# EAGLE design PIO-Dev-Lite (EAGLE 9.6.2)
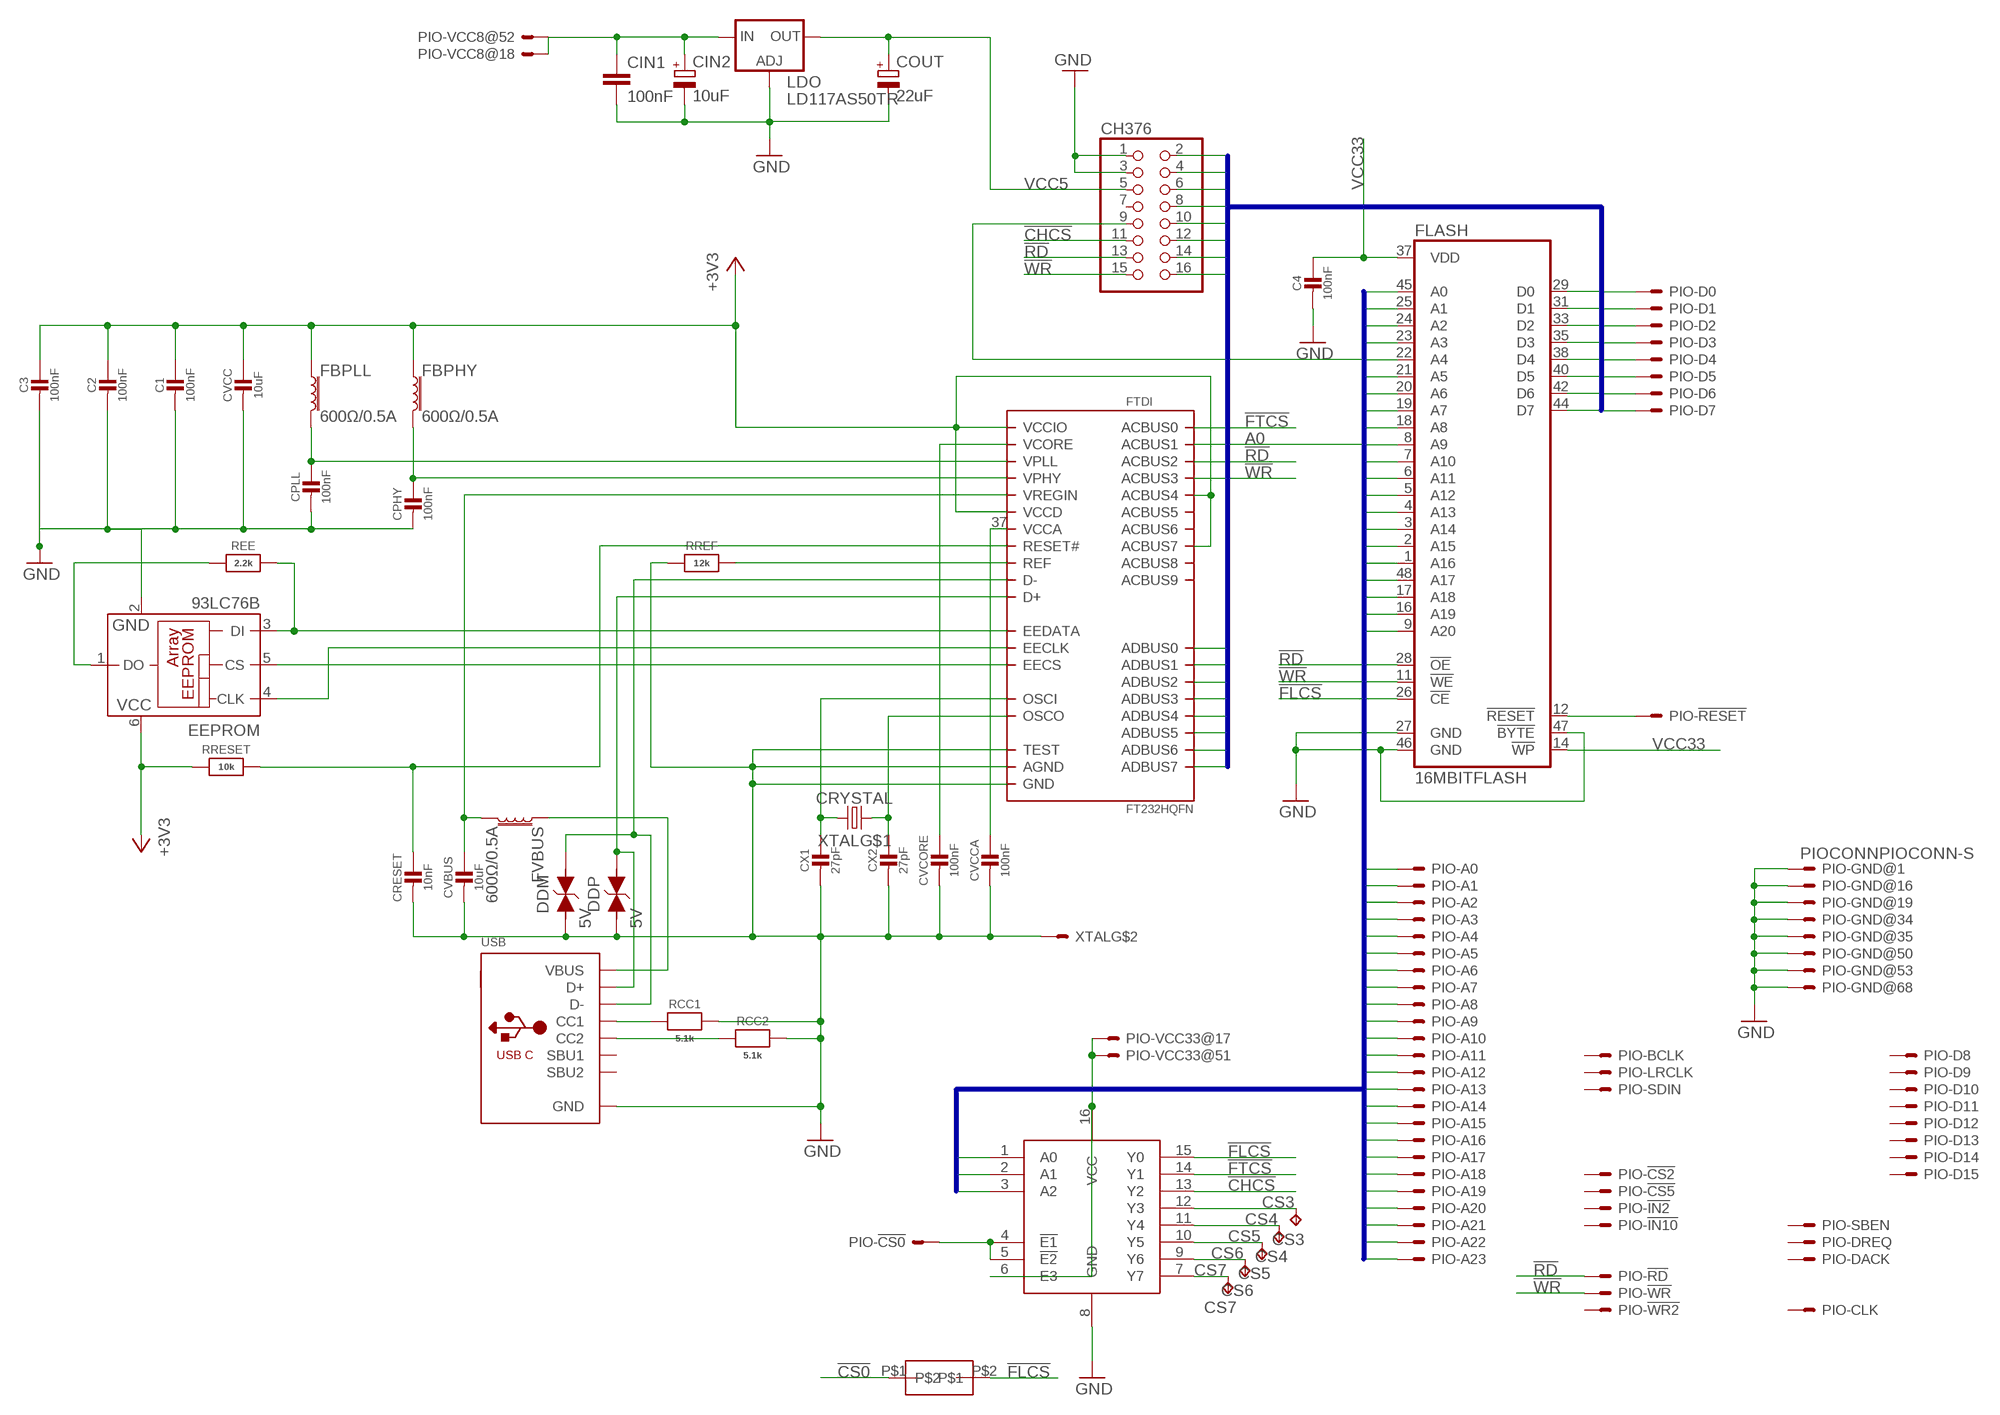
[diagram p0: schematic, sheet 1]

## Parts
C1  100nF  CAPACITOR0603  [0603]
C2  100nF  CAPACITOR0603  [0603]
C3  100nF  CAPACITOR0603  [0603]
C4  100nF  CAPACITOR0603  [0603]
CH376  PINHD-2X8  [2X08]
CIN1  100nF  C-EUC0603K  [C0603K]
CIN2  10uF  CPOL-EUA/3216-18W  [A/3216-18W]
COUT  22uF  CPOL-EUA/3216-18W  [A/3216-18W]
CPHY  100nF  CAPACITOR0603  [0603]
CPLL  100nF  CAPACITOR0603  [0603]
CRESET  10nF  CAPACITOR0603  [0603]
CS3  TP  [TP]
CS4  TP  [TP]
CS5  TP  [TP]
CS6  TP  [TP]
CS7  TP  [TP]
CVBUS  10uF  CAPACITOR1206  [1206]
CVCC  10uF  CAPACITOR1206  [1206]
CVCCA  100nF  CAPACITOR0603  [0603]
CVCORE  100nF  CAPACITOR0603  [0603]
CX1  27pF  CAPACITOR0402  [0402]
CX2  27pF  CAPACITOR0402  [0402]
DDM  5V  WE-VE_0603_82356050050  [WE-VE_0603]
DDP  5V  WE-VE_0603_82356050050  [WE-VE_0603]
DECODER  74HC138  [TSSOP16]
EEPROM  93LC76B  [SOT23-6]
FBPHY  600Ω/0.5A  FERRITE_BEAD-0603  [0603]
FBPLL  600Ω/0.5A  FERRITE_BEAD-0603  [0603]
FLASH  16MBITFLASH  [TSOP48]
FTDI  FT232HQFN  [QFN48_8MM]
FVBUS  600Ω/0.5A  FERRITE_BEAD-0603  [0603]
LDO  LD117AS50TR  [SOT223]
NOUSB  SMD-JUMPER  [SMD-JUMPER]
PIO  PIOCONNPIOCONN-S  [PIOCONN]
RCC1  5.1k  RESISTOR0402  [0402]
RCC2  5.1k  RESISTOR0402  [0402]
REE  2.2k  RESISTOR0603  [0603]
RREF  12k  RESISTOR0603  [0603]
RRESET  10k  RESISTOR0603  [0603]
USB  USB-C  [USB-C]
XTAL  CRYSTAL  [SMD3225-4P]

## Nets
!CHCS: CH376.11 DECODER.13(Y2)
!CS0: DECODER.4(!E1) DECODER.5(!E2) NOUSB.P$1 PIO.4
!FLCS: DECODER.15(Y0) FLASH.26(!CE) NOUSB.P$2
!FTCS: DECODER.14(Y1) FTDI.21(ACBUS0)
!RD: CH376.13 FLASH.28(!OE) FTDI.26(ACBUS2) PIO.30
!RESET: FLASH.12(!RESET) PIO.2
!RESET_FT: CRESET.1 FTDI.34(RESET#) RRESET.2
!WR: CH376.15 FLASH.11(!WE) FTDI.27(ACBUS3) PIO.64
+3V3: C1.1 C2.1 C3.1 CVCC.1 EEPROM.6(VCC) FBPHY.1 FBPLL.1 FTDI.12(VCCIO) FTDI.24(VCCIO) FTDI.28(ACBUS4) FTDI.31(ACBUS7) FTDI.39(VCCD) FTDI.46(VCCIO) RRESET.1
A0: CH376.9 FLASH.45(A0) FTDI.25(ACBUS1) PIO.14
A1: FLASH.25(A1) PIO.48
A2: FLASH.24(A2) PIO.15
A3: FLASH.23(A3) PIO.49
A4: FLASH.22(A4) PIO.20
A5: FLASH.21(A5) PIO.54
A6: FLASH.20(A6) PIO.21
A7: FLASH.19(A7) PIO.55
A8: FLASH.18(A8) PIO.22
A9: FLASH.8(A9) PIO.56
A10: FLASH.7(A10) PIO.23
A11: FLASH.6(A11) PIO.57
A12: FLASH.5(A12) PIO.24
A13: FLASH.4(A13) PIO.58
A14: FLASH.3(A14) PIO.25
A15: FLASH.2(A15) PIO.59
A16: FLASH.1(A16) PIO.26
A17: FLASH.48(A17) PIO.60
A18: FLASH.17(A18) PIO.27
A19: FLASH.16(A19) PIO.61
A20: FLASH.9(A20) PIO.28
A21: DECODER.1(A0) PIO.62
A22: DECODER.2(A1) PIO.29
A23: DECODER.3(A2) PIO.63
CC1: RCC1.1 USB.A5(CC1)
CC2: RCC2.1 USB.B5(CC2)
CS3: CS3.P$1(TP) DECODER.12(Y3)
CS4: CS4.P$1(TP) DECODER.11(Y4)
CS5: CS5.P$1(TP) DECODER.10(Y5)
CS6: CS6.P$1(TP) DECODER.9(Y6)
CS7: CS7.P$1(TP) DECODER.7(Y7)
D0: CH376.2 FLASH.29(D0) FTDI.13(ADBUS0) PIO.6
D1: CH376.4 FLASH.31(D1) FTDI.14(ADBUS1) PIO.40
D2: CH376.6 FLASH.33(D2) FTDI.15(ADBUS2) PIO.7
D3: CH376.8 FLASH.35(D3) FTDI.16(ADBUS3) PIO.41
D4: CH376.10 FLASH.38(D4) FTDI.17(ADBUS4) PIO.8
D5: CH376.12 FLASH.40(D5) FTDI.18(ADBUS5) PIO.42
D6: CH376.14 FLASH.42(D6) FTDI.19(ADBUS6) PIO.9
D7: CH376.16 FLASH.44(D7) FTDI.20(ADBUS7) PIO.43
DM: DDM.1 FTDI.6(D-) USB.A7(D-) USB.B7(D-)
DP: DDP.1 FTDI.7(D+) USB.A6(D+) USB.B6(D+)
EECLK: EEPROM.4(CLK) FTDI.44(EECLK)
EECS: EEPROM.5(CS) FTDI.45(EECS)
EEDATA: EEPROM.3(DI) FTDI.43(EEDATA) REE.2
EEDO: EEPROM.1(DO) REE.1
GND: C1.2 C2.2 C3.2 C4.2 CH376.1 CH376.3 CIN1.2 CIN2.- COUT.- CPHY.2 CPLL.2 CRESET.2 CVBUS.2 CVCC.2 CVCCA.2 CVCORE.2 CX1.2 CX2.2 DDM.2 DDP.2 DECODER.8(GND) EEPROM.2(GND) FLASH.27(GND) FLASH.46(GND) FLASH.47(!BYTE) FTDI.4(AGND) FTDI.9(AGND) FTDI.10(GND) FTDI.11(GND) FTDI.22(GND) FTDI.23(GND) FTDI.35(GND) FTDI.36(GND) FTDI.41(AGND) FTDI.42(TEST) FTDI.47(GND) FTDI.48(GND) FTDI.THERMAL(GND) LDO.1(ADJ) PIO.1 PIO.16 PIO.19 PIO.34 PIO.35 PIO.50 PIO.53 PIO.68 RCC1.2 RCC2.2 RREF.1 USB.A1B12(GND) USB.B1A12(GND) USB.M1(GND) USB.M2(GND) USB.M3(GND) USB.M4(GND) XTAL.P$2(S) XTAL.P$4(S)
REF: FTDI.5(REF) RREF.2
VBUS: FVBUS.1 USB.A4B9(VBUS) USB.B4A9(VBUS)
VCC5: CH376.5 COUT.+ LDO.4(OUT)
VCC8: CIN1.1 CIN2.+ LDO.3(IN) PIO.18 PIO.52
VCC33: C4.1 DECODER.6(E3) DECODER.16(VCC) FLASH.14(!WP) FLASH.37(VDD) PIO.17 PIO.51
VCCA: CVCCA.1 FTDI.37(VCCA)
VCORE: CVCORE.1 FTDI.38(VCORE)
VPHY: CPHY.1 FBPHY.2 FTDI.3(VPHY)
VPLL: CPLL.1 FBPLL.2 FTDI.8(VPLL)
VREGIN: CVBUS.1 FTDI.40(VREGIN) FVBUS.2
XI: CX1.1 FTDI.1(OSCI) XTAL.P$1(X1)
XO: CX2.1 FTDI.2(OSCO) XTAL.P$3(X2)
Unconnected: CH376.7 FTDI.29(ACBUS5) FTDI.30(ACBUS6) FTDI.32(ACBUS8) FTDI.33(ACBUS9) PIO.3 PIO.5 PIO.10 PIO.11 PIO.12 PIO.13 PIO.31 PIO.32 PIO.33 PIO.36 PIO.37 PIO.38 PIO.39 PIO.44 PIO.45 PIO.46 PIO.47 PIO.65 PIO.66 PIO.67 USB.A8(SBU1) USB.B8(SBU2)

## Buses
A[0..23]
D[0..7]

## Library data of the parts
C1-C4 CPHY CPLL CRESET CVBUS CVCC CVCCA CVCORE CX1 CX2 = pixel:CAPACITOR
CH376 = pinhead:PINHD-2X8: PIN HEADER
CIN1 = rcl:C-EU: CAPACITOR, European symbol; SPICEPREFIX: C
CIN2 COUT = rcl:CPOL-EU: POLARIZED CAPACITOR, European symbol; SPICEPREFIX: C
CS3-CS7 = pixel:TP
DDM DDP = Wurth_EMC Components_WE-VE:WE-VE_0603: WE-VE ESD Suppressor Characteristics Fast response time No leakage current Low clamping voltage Almost no energy consumption in stand-by mode Excellent absorption for ESD-impulses Operating temperature: –40 ºC to +85 ºC Nickel barrier Applications Protection of data lines Protection of bus systems Protection of semiconductors ESD protection in accordance with EN 61000-4-2: – 8 kV contact discharge – 15 kV air discharge <https://katalog.we-online.de/media/images/v2/o14891v209%20Family_WE-VE.jpg> Details see: https://katalog.we-online.de/en/pbs/WE-VE Updated by Ella Wu 2019-07-04 2019 (C) Wurth Elektronik; DATASHEET-URL: https://katalog.we-online.de/pbs/datasheet/82356050050.pdf; ILEAK: 1uA; MOUNT: SMT; PART-NUMBER: 82356050050; RISO: 10 MOhm; VCLAMP-TYP: 75V; VESD-AIR: 15kV
DECODER = pixel:74HC138
EEPROM = microchip:93*76?: 8K Microwire Compatible Serial EEPROM Source: http://ww1.microchip.com/downloads/en/DeviceDoc/21796H.pdf; MF: MICROCHIP; MPN: 93LC76BT-I/OT; OC_FARNELL: 1556170; OC_NEWARK: 61H6848
FBPHY FBPLL FVBUS = SparkFun-Coils:FERRITE_BEAD: Ferrite Bead (blocks, cores, rings, chokes, etc.) Inductor with layers of ferrite used to suppress high frequencies. Often used to isolate high frequency noise. SparkFun Products: IOIO-OTG - V2.2 <https://www.sparkfun.com/products/13613> SparkFun SAMD21 Mini Breakout <https://www.sparkfun.com/products/13664> SparkFun 6 Degrees of Freedom Breakout - LSM6DS3 <https://www.sparkfun.com/products/13339> SparkFun SAMD21 Dev Breakout <https://www.sparkfun.com/products/13672>; PROD_ID: NDUC-07859; VALUE: 30Ω/1.8A
FLASH = pixel:16MBITFLASH
FTDI = pixel:FT232H
LDO = v-reg:LD117A?*: Low drop fixed and adjustable positive voltage regulators 1 A Source: http://www.st.com/stonline/products/literature/ds/7194/ld1117axx.pdf
NOUSB = pixel:SMD-JUMPER
PIO = pixel:PIOCONN: CONNECTOR 68-pin 1.27mm (.050 inch) pitch SCSI+ unshielded receptacle right angle all plastic
RCC1 RCC2 REE RREF RRESET = pixel:RESISTOR
USB = pixel:USB-C: USB Type-C USB 2.0 Connector
XTAL = pixel:CRYSTAL

## Board
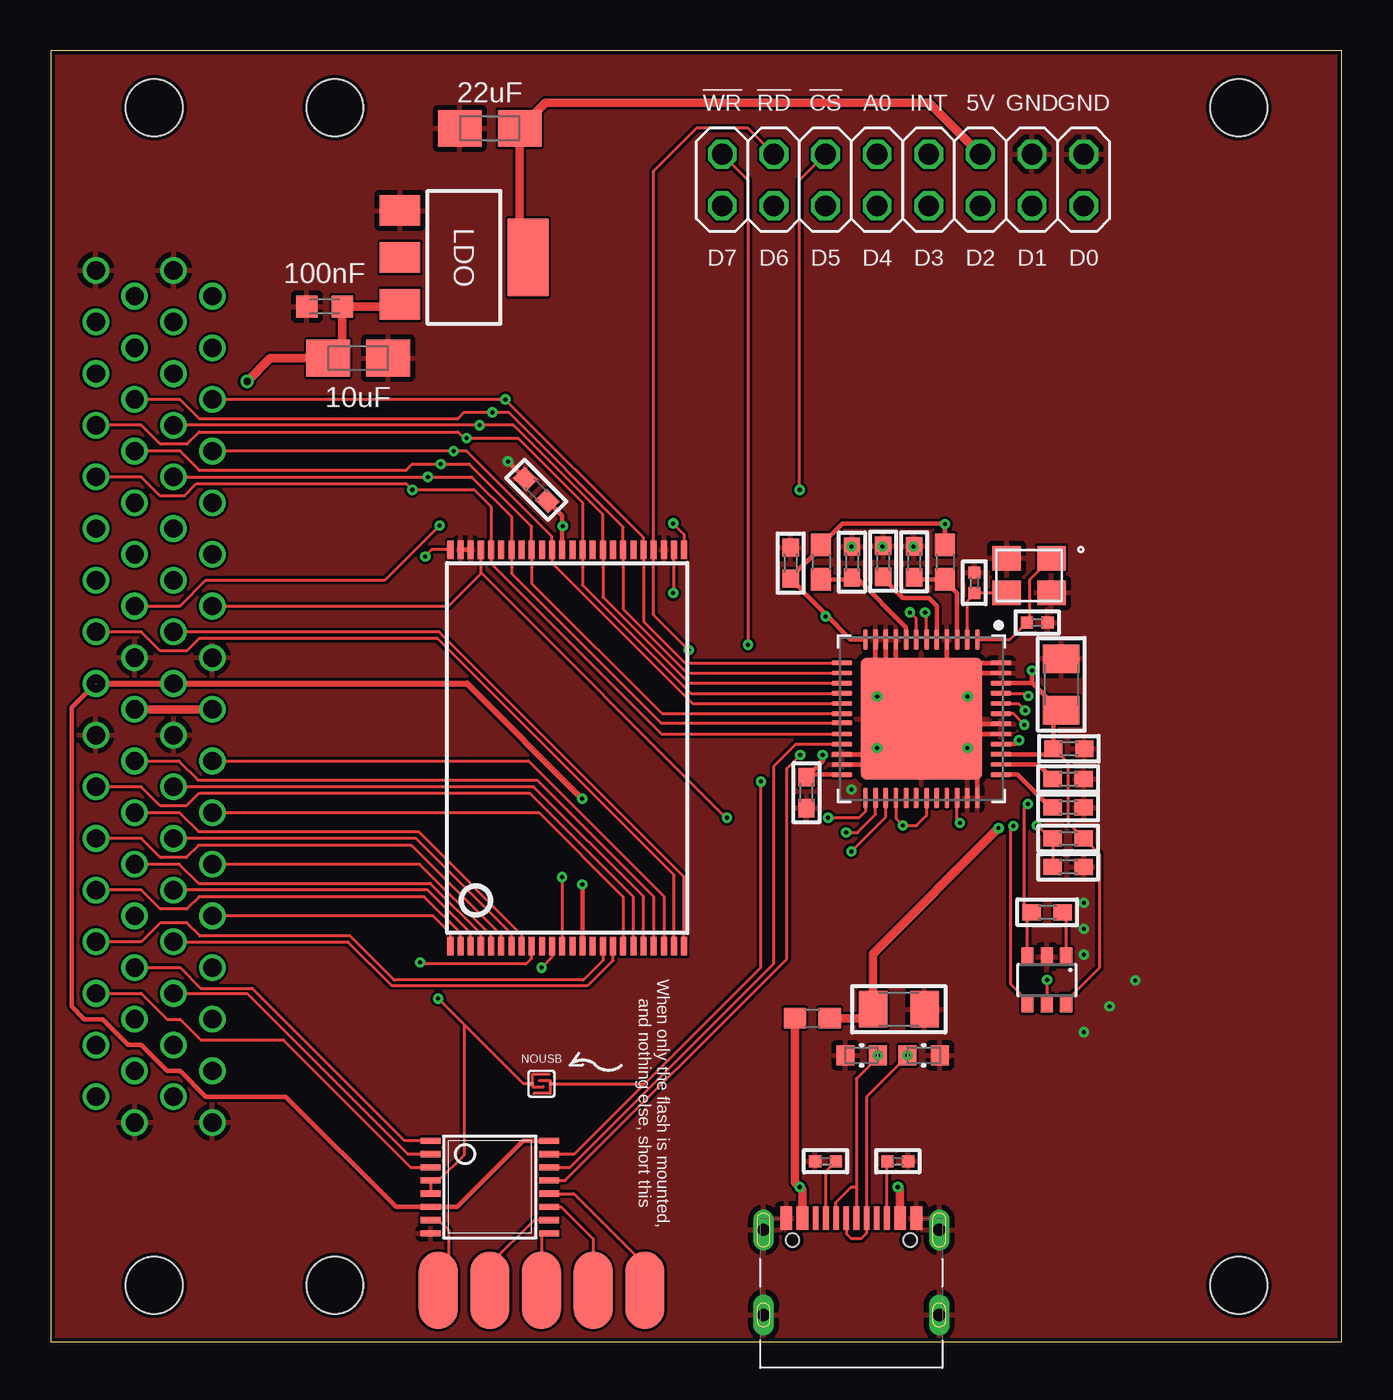
[diagram p1: board, top side]
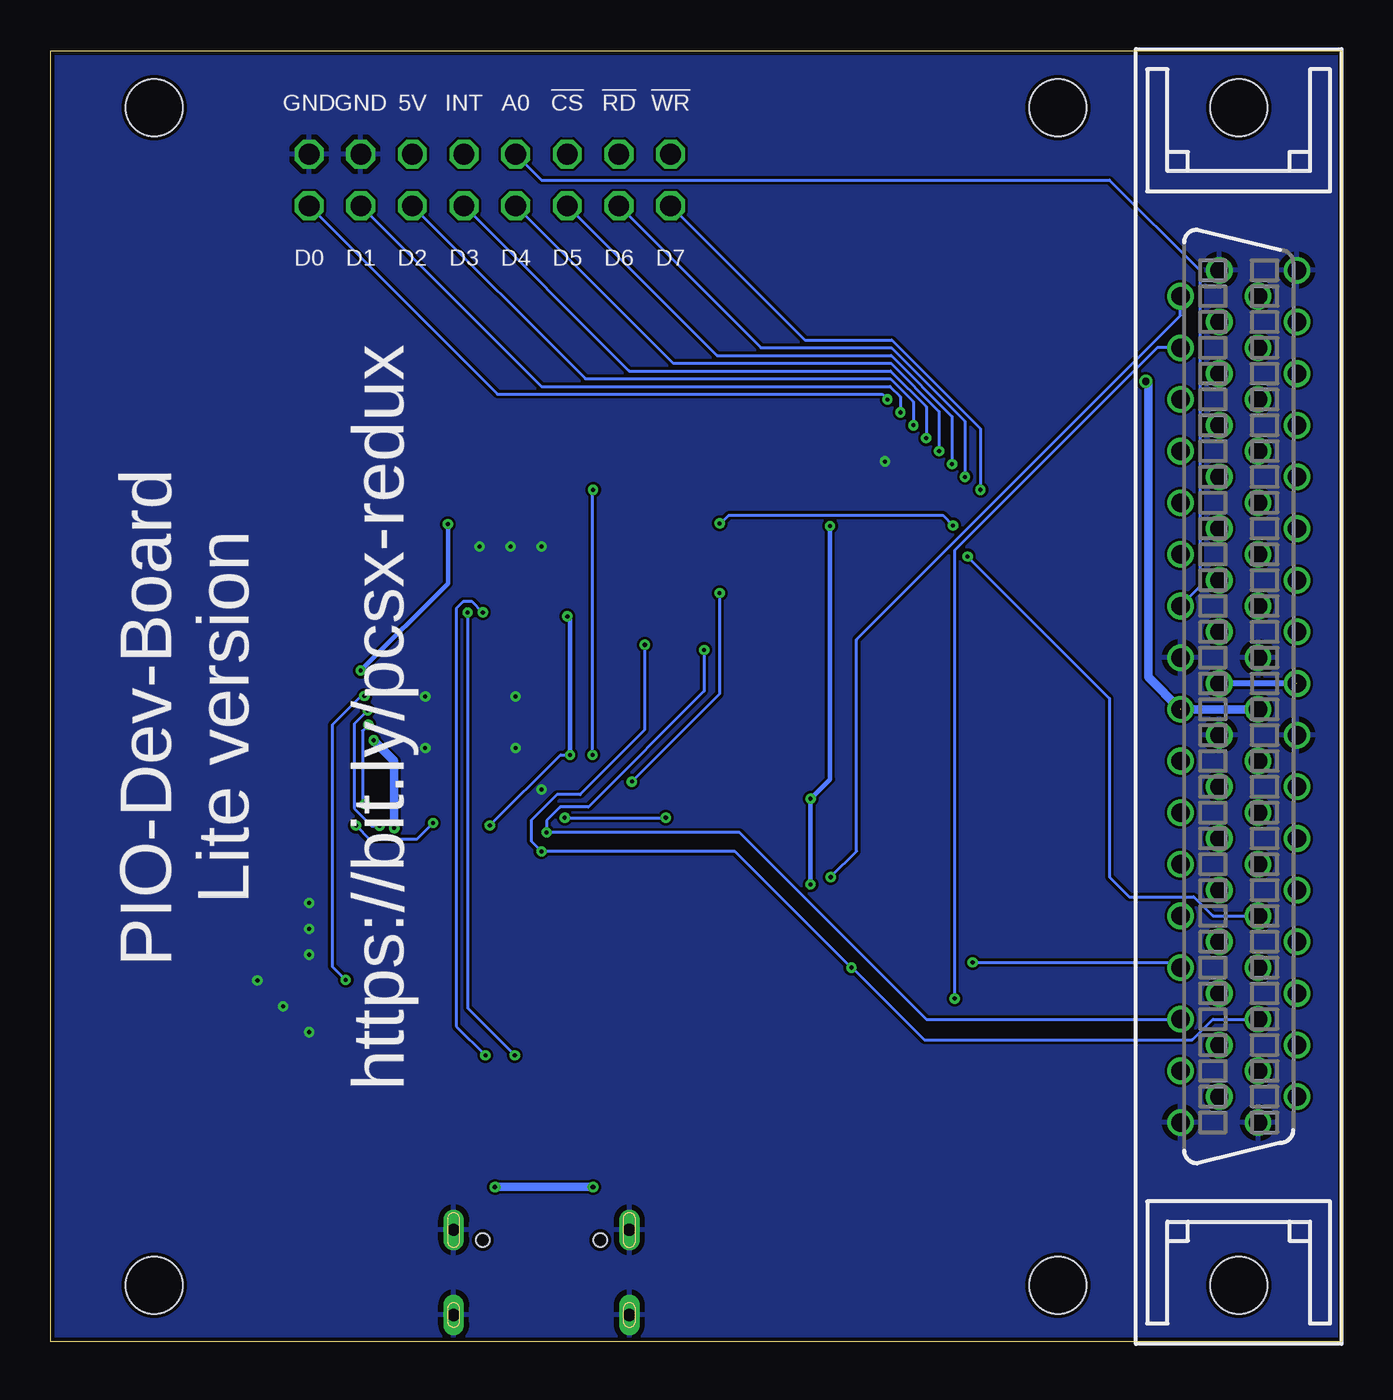
[diagram p2: board, bottom side, seen from below]

Size 63.5 x 63.5 mm. Coordinates in mm from the lower left corner, seen from the top.
Outline: 0,0 63.5,0 63.5,63.5 0,63.5 0,0
Copper layers (1*16): Top 0.035mm / dielectric 1.5mm / Bottom 0.035mm
Design rules "default *": minimum track width 5mil, minimum drill 0.2mm, track to track 5mil, track to pad 0.2mm, pad to pad 5mil, via to via 0.2mm, smd to smd 5mil, copper to edge 0.2mm, drill to drill 6mil, minimum pad ring 8mil, minimum via ring 0.15mm, stop-mask expansion 4mil, vias tented up to drill 25mil, thermal gap 10mil
Holes 2.79 mm at 58.42,60.71 58.42,2.79 13.97,60.71 13.97,2.79

### Footprints (pad centres in the part's own frame; a part is rotated, then mirrored left to right if it is on the bottom)
0603 = smd 0.9 x 0.8: 1 -0.762,0; 2 0.762,0
2X08 = drill 1.016 octagon: 1 -8.89,-1.27; 2 -8.89,1.27; 3 -6.35,-1.27; 4 -6.35,1.27; 5 -3.81,-1.27; 6 -3.81,1.27; 7 -1.27,-1.27; 8 -1.27,1.27; 9 1.27,-1.27; 10 1.27,1.27; 11 3.81,-1.27; 12 3.81,1.27; 13 6.35,-1.27; 14 6.35,1.27; 15 8.89,-1.27; 16 8.89,1.27
C0603K = smd 1.05 x 1.08: 1 -0.875,0; 2 0.875,0
A/3216-18W = smd 2.15 x 1.8: + 1.475,0; - -1.475,0
TP = smd 3.81 x 1.93: P$1 0,0
1206 = smd 1.4 x 1.8: 1 -1.27,0; 2 1.27,0
0402 = smd 0.6 x 0.6: 1 -0.508,0; 2 0.508,0
WE-VE_0603 = smd 0.9 x 1: 1 -0.8,0; 2 0.8,0
TSSOP16 = smd 0.305 x 0.991: 1 -2.275,-2.918; 2 -1.625,-2.918; 3 -0.975,-2.918; 4 -0.325,-2.918; 5 0.325,-2.918; 6 0.975,-2.918; 7 1.625,-2.918; 8 2.275,-2.918; 9 2.275,2.918; 10 1.625,2.918; 11 0.975,2.918; 12 0.325,2.918; 13 -0.325,2.918; 14 -0.975,2.918; 15 -1.625,2.918; 16 -2.275,2.918
SOT23-6 = smd 0.6 x 0.9: 1 -0.95,-1.15; 2 0,-1.15; 3 0.95,-1.15; 4 0.95,1.15; 5 0,1.15; 6 -0.95,1.15
0603' = smd 1.1 x 1: 1 -0.85,0; 2 0.85,0
TSOP48 = smd 0.9 x 0.3: 1 -9.75,5.75; 2 -9.75,5.25; 3 -9.75,4.75; 4 -9.75,4.25; 5 -9.75,3.75; 6 -9.75,3.25; 7 -9.75,2.75; 8 -9.75,2.25; 9 -9.75,1.75; 10 -9.75,1.25; 11 -9.75,0.75; 12 -9.75,0.25; 13 -9.75,-0.25; 14 -9.75,-0.75; 15 -9.75,-1.25; 16 -9.75,-1.75; 17 -9.75,-2.25; 18 -9.75,-2.75; 19 -9.75,-3.25; 20 -9.75,-3.75; 21 -9.75,-4.25; 22 -9.75,-4.75; 23 -9.75,-5.25; 24 -9.75,-5.75; 25 9.75,-5.75; 26 9.75,-5.25; 27 9.75,-4.75; 28 9.75,-4.25; 29 9.75,-3.75; 30 9.75,-3.25; 31 9.75,-2.75; 32 9.75,-2.25; 33 9.75,-1.75; 34 9.75,-1.25; 35 9.75,-0.75; 36 9.75,-0.25; 37 9.75,0.25; 38 9.75,0.75; 39 9.75,1.25; 40 9.75,1.75; 41 9.75,2.25; 42 9.75,2.75; 43 9.75,3.25; 44 9.75,3.75; 45 9.75,4.25; 46 9.75,4.75; 47 9.75,5.25; 48 9.75,5.75
QFN48_8MM = smd 1 x 0.23: 1 -3.9,2.75; 2 -3.9,2.25; 3 -3.9,1.75; 4 -3.9,1.25; 5 -3.9,0.75; 6 -3.9,0.25; 7 -3.9,-0.25; 8 -3.9,-0.75; 9 -3.9,-1.25; 10 -3.9,-1.75; 11 -3.9,-2.25; 12 -3.9,-2.75; 25 3.9,-2.75; 26 3.9,-2.25; 27 3.9,-1.75; 28 3.9,-1.25; 29 3.9,-0.75; 30 3.9,-0.25; 31 3.9,0.25; 32 3.9,0.75; 33 3.9,1.25; 34 3.9,1.75; 35 3.9,2.25; 36 3.9,2.75 | smd 0.23 x 1: 13 -2.75,-3.9; 14 -2.25,-3.9; 15 -1.75,-3.9; 16 -1.25,-3.9; 17 -0.75,-3.9; 18 -0.25,-3.9; 19 0.2,-3.9; 20 0.75,-3.9; 21 1.25,-3.9; 22 1.75,-3.9; 23 2.25,-3.9; 24 2.75,-3.9; 37 2.75,3.9; 38 2.25,3.9; 39 1.75,3.9; 40 1.25,3.9; 41 0.75,3.9; 42 0.25,3.9; 43 -0.25,3.9; 44 -0.75,3.9; 45 -1.25,3.9; 46 -1.75,3.9; 47 -2.25,3.9; 48 -2.75,3.9 | smd 6 x 6: THERMAL 0,0
SOT223 = smd 1.5 x 2: 1 -2.3,-3.15; 2 0,-3.15; 3 2.3,-3.15 | smd 3.8 x 2: 4 0,3.15
SMD-JUMPER = smd 0.254 x 0.152: P$1 -0.508,0; P$2 0.508,0
PIOCONN = drill 0.9 pad 1.27: 1 20.955,0.953; 2 19.685,2.863; 3 18.415,0.953; 4 17.145,2.863; 5 15.875,0.953; 6 14.605,2.863; 7 13.335,0.953; 8 12.065,2.863; 9 10.795,0.953; 10 9.525,2.863; 11 8.255,0.953; 12 6.985,2.863; 13 5.715,0.953; 14 4.445,2.863; 15 3.175,0.953; 16 1.905,2.863; 17 0.635,0.953; 18 -0.635,2.863; 19 -1.905,0.953; 20 -3.175,2.863; 21 -4.445,0.953; 22 -5.715,2.863; 23 -6.985,0.953; 24 -8.255,2.863; 25 -9.525,0.953; 26 -10.795,2.863; 27 -12.065,0.953; 28 -13.335,2.863; 29 -14.605,0.953; 30 -15.875,2.863; 31 -17.145,0.953; 32 -18.415,2.863; 33 -19.685,0.953; 34 -20.955,2.863; 35 20.955,-2.867; 36 19.685,-0.957; 37 18.415,-2.867; 38 17.145,-0.957; 39 15.875,-2.867; 40 14.605,-0.957; 41 13.335,-2.867; 42 12.065,-0.957; 43 10.795,-2.867; 44 9.525,-0.957; 45 8.255,-2.867; 46 6.985,-0.957; 47 5.715,-2.867; 48 4.445,-0.957; 49 3.175,-2.867; 50 1.905,-0.957; 51 0.635,-2.867; 52 -0.635,-0.957; 53 -1.905,-2.867; 54 -3.175,-0.957; 55 -4.445,-2.867; 56 -5.715,-0.957; 57 -6.985,-2.867; 58 -8.255,-0.957; 59 -9.525,-2.867; 60 -10.795,-0.957; 61 -12.065,-2.867; 62 -13.335,-0.957; 63 -14.605,-2.867; 64 -15.875,-0.957; 65 -17.145,-2.867; 66 -18.415,-0.957; 67 -19.685,-2.867; 68 -20.955,-0.957 | hole 2.8: -28.955,0; 28.955,0
USB-C = smd 0.575 x 1.15: A1B12 -3.2,3.545; A4B9 -2.4,3.545; B1A12 3.2,3.545; B4A9 2.4,3.545 | smd 0.275 x 1.15: A5 -1.25,3.545; A6 -0.25,3.545; A7 0.25,3.545; A8 1.25,3.545; B5 1.75,3.545; B6 0.75,3.545; B7 -0.75,3.545; B8 -1.75,3.545 | drill 0.6 pad 1 long: M1 -4.32,2.97; M2 4.32,2.97; M3 -4.32,-1.21; M4 4.32,-1.21 | hole 0.65: 2.89,2.47; -2.89,2.47
SMD3225-4P = smd 1.4 x 1.2: P$1 -1.1,-0.85; P$2 1.1,-0.85; P$3 1.1,0.85; P$4 -1.1,0.85

### Placement (x,y rotation side)
C1  36.39,38.31 90 top
C2  50.07,29.18 0 top
C3  37.16,27.02 270 top
C4  23.88,41.91 135 top
CH376  41.91,57.15 180 top
CIN1  13.46,50.93 180 top
CIN2  15.11,48.39 180 top
COUT  21.59,59.69 0 top
CPHY  42.46,38.37 90 top
CPLL  39.4,38.35 90 top
CRESET  50.04,23.37 0 top
CS3  29.21,2.54 90 top
CS4  26.67,2.54 90 top
CS5  21.59,2.54 90 top
CS6  24.13,2.54 90 top
CS7  19.05,2.54 90 top
CVBUS  41.7,16.36 0 top
CVCC  49.69,32.34 90 top
CVCCA  50.04,26.29 0 top
CVCORE  50.04,27.69 0 top
CX1  48.51,35.38 0 top
CX2  45.42,37.34 90 top
DDM  39.88,14.1 180 top
DDP  42.93,14.1 0 top
DECODER  21.59,7.62 270 top
EEPROM  48.98,17.8 180 top
FBPHY  600Ω/0.5A  [0603']  43.97,38.35 270 top
FBPLL  600Ω/0.5A  [0603']  37.88,38.35 270 top
FLASH  25.4,29.21 90 top
FTDI  42.82,30.65 270 top
FVBUS  600Ω/0.5A  [0603']  37.45,15.92 0 top
LDO  20.32,53.34 270 top
NOUSB  24.13,12.7 0 top
PIO  5.08,31.75 90 bottom
RCC1  38.1,8.89 180 top
RCC2  41.66,8.89 0 top
REE  49.01,21.13 180 top
RREF  40.94,38.39 270 top
RRESET  50.04,24.77 180 top
USB  39.37,2.54 0 top
XTAL  48.12,37.7 180 top

### Tracks (layer width: path | path; a pad name or v marks a point on that pad's centre or on a via)
!CHCS  (via drill 0.2)
  Top 0.152: DECODER.13 25.29,7.95 36.2,18.85 36.2,28.21 v36.86,28.87 | v36.83,41.91 36.83,57.15 CH376.11
  Bottom 0.152: v36.86,28.87 36.86,41.88 v36.83,41.91
!CS0  (via drill 0.2)
  Top 0.152: DECODER.5 DECODER.4 19.08,7.95 20.32,9.18 20.32,15.62 | v19.05,16.89 20.32,15.62 | NOUSB.P$1 23.24,12.7 20.32,15.62
  Bottom 0.152: PIO.4 9.09,48.9 19.05,38.93 v19.05,16.89
!FLCS  (via drill 0.2)
  Top 0.152: v34.92,27.56 34.92,18.41 29.21,12.7 | v30.61,36.83 30.65,36.87 FLASH.26 | DECODER.15 25.75,9.24 29.21,12.7 | NOUSB.P$2 29.21,12.7
  Bottom 0.152: v34.92,27.56 30.61,31.88 v30.61,36.83
!FTCS
  Top 0.152: DECODER.14 25.54,8.6 35.56,18.62 35.56,28.32 36.64,29.4 FTDI.21
!RD  (via drill 0.2)
  Top 0.152: v39.12,25.06 39.68,25.06 40.57,25.95 FTDI.26 | v31.37,34.04 29.65,35.76 FLASH.28 29.65,57.59 31.75,59.69 34.29,59.69 CH376.13
  Bottom 0.152: v31.37,34.04 31.37,32 37.06,26.31 38.45,26.31 39.12,25.64 v39.12,25.06 29.63,25.06 20.45,15.88 PIO.30
!RESET  (via drill 0.2)
  Top 0.152: v25.15,22.86 FLASH.12
  Bottom 0.152: v25.15,22.86 23.88,24.13 23.88,34.54 7.94,50.48 PIO.2
!RESET_FT  (via drill 0.2)
  Top 0.152: CRESET.1 RRESET.2 49.15,24.77 48.51,25.4 v48.49,25.4 | v44.7,25.53 44.57,25.66 FTDI.34
  Bottom 0.152: v48.49,25.4 47.84,24.75 45.49,24.75 v44.7,25.53
!WR  (via drill 0.2)
  Top 0.152: v39.37,24.13 41.07,25.83 FTDI.27 | FLASH.11 24.65,18.93 v24.13,18.41 | CH376.15 34.29,57.15 v34.29,34.29
  Bottom 0.152: PIO.64 6.35,15.88 7.37,14.86 20.54,14.86 24.09,18.41 v24.13,18.41 29.85,24.13 v39.37,24.13 39.88,24.64 39.88,25.65 38.61,26.92 37.47,26.92 34.29,30.1 v34.29,34.29
+3V3  (via drill 0.2)
  Top 0.152: 49.31,29.21 50.04,28.48 50.04,25.53 RRESET.1 51.56,24 51.56,18.4 49.93,16.78 EEPROM.6 | FTDI.28 41.57,25.74 v41.91,25.4 42.57,25.4 43.07,25.89 FTDI.31
  Top 0.229: 48.26,32.4 49.59,31.07 CVCC.1 49.53,31.07 49.31,30.84 49.31,29.21 C2.1 49.03,28.9 FTDI.39 | FTDI.12 39.34,34.55 38.09,35.8 | 38.09,35.8 37.06,36.82 37.06,36.87 C1.1 36.39,37.59 37.88,39.08 FBPLL.1 38.93,40.26 43.94,40.26 v43.97,40.22 FBPHY.1 | FTDI.24 37.28,27.9 C3.1 37.97,28.58 v37.97,28.87 | 48.26,32.4 v48.26,33.02 | v38.1,35.69 38.09,35.7 38.09,35.8 | FTDI.46 48.26,32.4
  Bottom 0.152: v41.91,25.4 38.43,28.88 v37.97,28.88
  Bottom 0.229: v48.26,33.02 43.97,37.31 v43.97,40.22 | v37.97,28.87 v37.97,28.88 37.97,35.69 v38.1,35.69
A0  (via drill 0.2)
  Top 0.152: PIO.14 19.56,36.2 21.15,37.79 21.15,37.85 | 21.15,37.85 FLASH.45 | FTDI.25 40.07,26.1 39.75,25.78 v38.23,25.78 | v33.25,25.78 33.22,25.78 21.15,37.85
  Bottom 0.152: v38.23,25.78 v33.25,25.78 | CH376.9 39.37,57.15 11.43,57.15 6.99,52.7 6.99,37.15 PIO.14
A1  (via drill 0.2)
  Top 0.152: PIO.48 6.35,36.2 7.62,37.47 16.43,37.47 v19.13,40.16 | v30.61,40.26 31.15,39.72 FLASH.25
  Bottom 0.152: v30.61,40.26 30.56,40.26 30.15,40.66 19.63,40.66 v19.13,40.16
A2
  Top 0.152: FLASH.24 31.15,22.88 19.1,34.92 PIO.15
A3
  Top 0.152: FLASH.23 30.65,22.97 19.03,34.59 7.29,34.59 6.68,33.99 5.38,33.99 4.45,34.92 PIO.49
A4
  Top 0.152: PIO.20 23.5,28.57 30.15,21.92 FLASH.22
A5
  Top 0.152: PIO.54 6.3,28.57 7.24,27.64 23.92,27.64 29.65,21.91 FLASH.21
A6
  Top 0.152: FLASH.20 29.15,21.9 23.75,27.3 PIO.21
A7
  Top 0.152: FLASH.19 28.65,21.9 23.57,26.97 7.26,26.97 6.66,26.37 5.38,26.37 4.45,27.3 PIO.55
A8
  Top 0.152: PIO.22 24,26.04 28.15,21.89 FLASH.18
A9
  Top 0.152: PIO.56 6.33,26.04 7.26,25.1 18.08,25.1 23.15,20.03 FLASH.8
A10
  Top 0.152: PIO.23 17.96,24.77 22.65,20.08 FLASH.7
A11
  Top 0.152: FLASH.6 22.15,20.01 17.73,24.43 7.26,24.43 6.66,23.83 5.38,23.83 4.45,24.77 PIO.57
A12
  Top 0.152: FLASH.5 21.65,19.99 18.15,23.5 PIO.24
A13
  Top 0.152: FLASH.4 21.15,20.07 18.66,22.56 7.26,22.56 6.33,23.5 PIO.58
A14
  Top 0.152: FLASH.3 20.65,20.12 18.54,22.23 PIO.25
A15
  Top 0.152: FLASH.2 20.15,20.11 18.37,21.89 7.29,21.89 6.68,21.29 5.38,21.29 4.45,22.23 PIO.59
A16
  Top 0.152: FLASH.1 19.65,20.09 18.79,20.95 PIO.26
A17  (via drill 0.2)
  Top 0.152: FLASH.48 18.74,38.96 v18.41,38.64 v18.41,38.63
  Bottom 0.152: v18.41,38.63 11.43,31.65 11.43,22.86 10.46,21.89 7.29,21.89 6.35,20.95 PIO.60
A18
  Top 0.152: PIO.27 14.61,19.68 16.76,17.53 26.42,17.53 27.65,18.76 FLASH.17
A19
  Top 0.152: FLASH.16 27.15,18.77 26.19,17.8 16.88,17.8 14.72,19.96 7.34,19.96 6.68,20.62 5.38,20.62 4.45,19.68 PIO.61
A20  (via drill 0.2)
  Top 0.152: v18.16,18.67 18.24,18.59 23.37,18.59 23.65,18.88 FLASH.9
  Bottom 0.152: PIO.28 8.2,18.67 v18.16,18.67
A21
  Top 0.152: PIO.62 6.35,18.41 7.37,17.4 9.91,17.4 17.41,9.89 DECODER.1
A22
  Top 0.152: PIO.29 6.06,17.12 9.68,17.12 17.55,9.24 DECODER.2
A23
  Top 0.152: DECODER.3 17.69,8.6 11.43,14.86 7.37,14.86 6.35,15.88 5.71,15.88 4.45,17.14 PIO.63
CC1
  Top 0.152: USB.A5 38.12,8.4 RCC1.1
CC2
  Top 0.152: USB.B5 41.12,7.39 41.12,7.4 41.12,8.86 RCC2.1
CS3
  Top 0.152: DECODER.12 25.73,7.29 29.21,3.81 CS3.P$1
CS4
  Top 0.152: DECODER.11 25.11,6.64 26.67,5.08 CS4.P$1
CS5
  Top 0.152: DECODER.10 23.77,6 21.59,3.81 CS5.P$1
CS6
  Top 0.152: DECODER.9 24.13,5.34 CS6.P$1
CS7
  Top 0.152: DECODER.7 19.07,6 19.56,5.51 19.56,4.14 19.05,3.63 CS7.P$1
D0  (via drill 0.2)
  Top 0.152: FTDI.13 31.19,33.4 29.15,35.44 FLASH.29 29.15,39.56 v22.35,46.35 PIO.6
  Bottom 0.152: CH376.2 41.53,46.61 22.61,46.61 v22.35,46.35
D1  (via drill 0.2)
  Top 0.152: FTDI.14 31.29,32.9 28.15,36.04 FLASH.31 28.15,40.08 22.51,45.72 v21.72,45.72 20.32,45.72 20.02,45.42 7.29,45.42 6.35,46.35 PIO.40
  Bottom 0.152: CH376.4 39.37,46.99 22.23,46.99 21.72,46.48 v21.72,45.72
D2  (via drill 0.2)
  Top 0.152: FTDI.15 31.38,32.4 27.15,36.63 FLASH.33 27.15,40.68 22.75,45.09 v21.08,45.09 PIO.7
  Bottom 0.152: CH376.6 37.21,47.37 22.21,47.37 21.08,46.24 v21.08,45.09
D3  (via drill 0.2)
  Top 0.152: FTDI.16 31.47,31.9 26.15,37.22 FLASH.35 26.15,41.29 22.99,44.45 v20.45,44.45 20.32,44.45 20.02,44.75 7.29,44.75 6.68,44.15 5.38,44.15 4.45,45.09 PIO.41
  Bottom 0.152: CH376.8 35.05,47.75 22.2,47.75 20.45,46 v20.45,44.45
D4  (via drill 0.2)
  Top 0.152: FTDI.17 31.57,31.4 24.65,38.32 FLASH.38 24.65,39.61 20.45,43.81 v19.81,43.81 PIO.8
  Bottom 0.152: CH376.10 32.89,48.13 22.18,48.13 19.81,45.76 v19.81,43.81
D5  (via drill 0.2)
  Top 0.152: FTDI.18 30.06,30.9 23.65,37.31 FLASH.40 23.65,40.1 20.57,43.18 v19.18,43.18 17.78,43.18 17.48,42.88 7.29,42.88 6.35,43.81 PIO.42
  Bottom 0.152: CH376.12 30.73,48.51 22.17,48.51 19.18,45.52 v19.18,43.18
D6  (via drill 0.2)
  Top 0.152: FTDI.19 30,30.45 22.65,37.8 FLASH.42 22.65,40.6 20.7,42.55 v18.54,42.55 PIO.9
  Bottom 0.152: CH376.14 28.57,48.9 22.15,48.9 18.54,45.28 v18.54,42.55
D7  (via drill 0.2)
  Top 0.152: FTDI.20 30.04,29.9 21.65,38.29 FLASH.44 21.65,41.09 20.83,41.91 v17.78,41.91 17.48,42.21 7.16,42.21 6.56,41.61 5.38,41.61 4.45,42.55 PIO.43
  Bottom 0.152: CH376.16 26.42,49.28 22.14,49.28 17.78,44.92 v17.78,41.91
DM  (via drill 0.2)
  Top 0.152: DDM.1 40.68,14.01 39.62,12.95 39.62,7.62 | FTDI.6 43.07,35.81 v43,35.88 | 39.62,7.62 USB.A7 | USB.B7 38.62,6.87 39.37,7.62 39.62,7.62
  Bottom 0.152: v43,35.88 43,16.42 DDM.1
  other vias: 40.68,14.1
DP  (via drill 0.2)
  Top 0.152: FTDI.7 42.57,35.57 v42.25,35.88 | DDP.1 42.13,14.06 40.12,12.05 USB.B6 40.12,5.35 39.85,5.08 39.37,5.08 39.12,5.33 USB.A6
  Bottom 0.152: v42.25,35.88 v42.26,35.88 42.78,36.41 43.22,36.41 43.56,36.07 43.56,15.53 DDP.1
  other vias: 42.13,14.1
EECLK  (via drill 0.2)
  Top 0.152: FTDI.44 47.58,31.4 v47.92,31.06 | v47.34,25.38 47.2,25.25 47.2,17.61 48.03,16.78 EEPROM.4
  Bottom 0.152: v47.92,31.06 48.58,30.4 48.58,26.24 47.71,25.38 v47.34,25.38
EECS  (via drill 0.2)
  Top 0.152: FTDI.45 47.95,31.9 v48.08,31.76 | v49,17.8 48.98,17.79 EEPROM.5
  Bottom 0.152: v48.08,31.76 48.25,31.76 49.66,30.35 49.66,18.47 v49,17.8
EEDATA  (via drill 0.2)
  Top 0.152: EEPROM.3 48.03,20.92 REE.2 47.86,21.51 47.86,26.27 v48.05,26.46 | v47.88,30.35 47.33,30.9 FTDI.43
  Bottom 0.152: v47.88,30.35 48.18,30.05 48.18,26.59 v48.05,26.46
EEDO
  Top 0.152: EEPROM.1 49.93,20.96 REE.1
GND  (via drill 0.2)
  Top 0.152: CPHY.2 42.44,39.12 v42.42,39.12 | RREF.1 40.9,39.12 v40.89,39.12
  Top 0.229: FTDI.42 43.07,30.4 40.57,32.9 FTDI.11 | FTDI.22 40.64,28.9 40.14,28.4 FTDI.23 | FTDI.48 45.74,33.4 44.07,31.73 44.07,33.02 | FTDI.4 44.07,33.02 | FTDI.10 41.07,32.18 | FTDI.36 45.57,28.09 43.18,30.48 42.82,30.48 | FTDI.41 43.03,29.9 42.82,30.12 | FTDI.47 44.19,32.9 44.07,33.02 | FTDI.9 41.57,33.36 43,31.93 43,30.66 | C4.2 v22.48,43.31 | v22.48,43.31 | FLASH.46 FLASH.47
  Top 0.406: 43.07,30.4 FTDI.THERMAL 42.82,30.48 | 40.64,28.9 41.6,28.9 42.82,30.12 42.82,30.48 | 44.07,31.73 43,30.66 | 43,30.66 42.82,30.48 | 41.07,32.18 v40.64,31.75 41.73,30.66 43,30.66
  other vias: 39.37,27.18 39.37,39.12 40.64,29.21 45.09,29.21 45.09,31.75 50.8,20.32 50.8,21.59 50.8,19.05 53.34,17.78 52.07,16.51 50.8,15.24
  pour Top: 0,63.5 63.5,63.5 63.5,0 0,0
  pour Bottom: 0,63.5 63.5,63.5 63.5,0 0,0
REF
  Top 0.229: FTDI.5 43.57,36.19 43.18,36.58 41.91,36.58 40.94,37.55 RREF.2
VBUS  (via drill 0.23)
  Top 0.406: USB.A4B9 36.97,7.48 v36.83,7.62 36.6,7.85 FVBUS.1 | USB.B4A9 41.77,7.51 v41.66,7.62
  Bottom 0.406: v41.66,7.62 v36.83,7.62
VCC5
  Top 0.406: CH376.5 43.18,60.96 24.34,60.96 COUT.+ 23.07,53.74 LDO.4
VCC8  (via drill 0.35)  (1 unrouted)
  Top 0.305: CIN2.+ 14.34,48.39 | 17.06,50.93 LDO.3
  Top 0.406: 14.34,48.39 CIN1.1 17.06,50.93 | PIO.52 PIO.18 | v9.65,47.24 10.79,48.39 CIN2.+
  Bottom 0.305: 9.53,47.12 v9.65,47.24
  Bottom 0.406: PIO.18 9.53,32.7 9.53,47.12 | 7.92,31.11 4.17,31.11
VCC33  (via drill 0.2)  (1 unrouted)
  Top 0.229: FLASH.37 25.15,40.16 | C4.1 25.15,40.64 25.15,40.16 | 25.15,40.16 v25.18,40.13 | v26.14,22.5 v26.15,22.49 FLASH.14 | DECODER.16 23.23,9.89 19.98,6.64 DECODER.6 16.98,6.64 11.56,12.06 7.62,12.06 6.35,13.34 5.71,13.34 4.45,14.61 3.81,14.61 2.54,15.88 1.65,15.88 1.03,16.5 1.03,31.2 PIO.51
  Top 0.305: v26.13,26.71 20.46,32.38 PIO.17 PIO.51
  Bottom 0.229: v26.14,22.5 26.14,23.16 26.13,23.16 v26.13,26.71 25.18,27.67 v25.18,40.13
  Bottom 0.305: 2.23,32.38 5.97,32.38
VCCA
  Top 0.229: FTDI.37 47.54,27.9 49.15,26.29 CVCCA.1
VCORE
  Top 0.229: FTDI.38 48.56,28.4 CVCORE.1
VPHY
  Top 0.229: FTDI.3 44.57,36.84 43.97,37.43 FBPHY.2 42.56,37.5 CPHY.1
VPLL
  Top 0.229: FTDI.8 42.07,35.15 39.62,37.59 CPLL.1 39.31,37.5 FBPLL.2
VREGIN  (via drill 0.2)
  Top 0.229: FTDI.40 47.43,29.4 v47.62,29.59
  Top 0.406: FVBUS.2 39.99,15.92 CVBUS.1 40.43,19.1 v46.61,25.27
  Bottom 0.406: v47.62,29.59 46.61,28.57 v46.61,25.27
XI
  Top 0.152: FTDI.1 47.17,34.55 CX1.1 48.13,35.51 48.13,37.47 XTAL.P$1
XO
  Top 0.152: XTAL.P$3 45.44,36.85 CX2.1 45.42,36.78 45.07,36.43 FTDI.2

### Text on the board
tPlace: 22uF | LDO | 100nF | 10uF | When only the flash is mounted, / and nothing else, short this
tNames: !WR | !RD | !CS | A0 | INT | 5V | GND | GND | D7 | D6 | D5 | D4 | D3 | D2 | D1 | D0
bNames: !WR | !RD | !CS | A0 | INT | 5V | GND | GND | D7 | D6 | D5 | D4 | D3 | D2 | D1 | D0 | PIO-Dev-Board / Lite version / / https://bit.ly/pcsx-redux